# EAGLE design schematic (EAGLE 9.6.2)
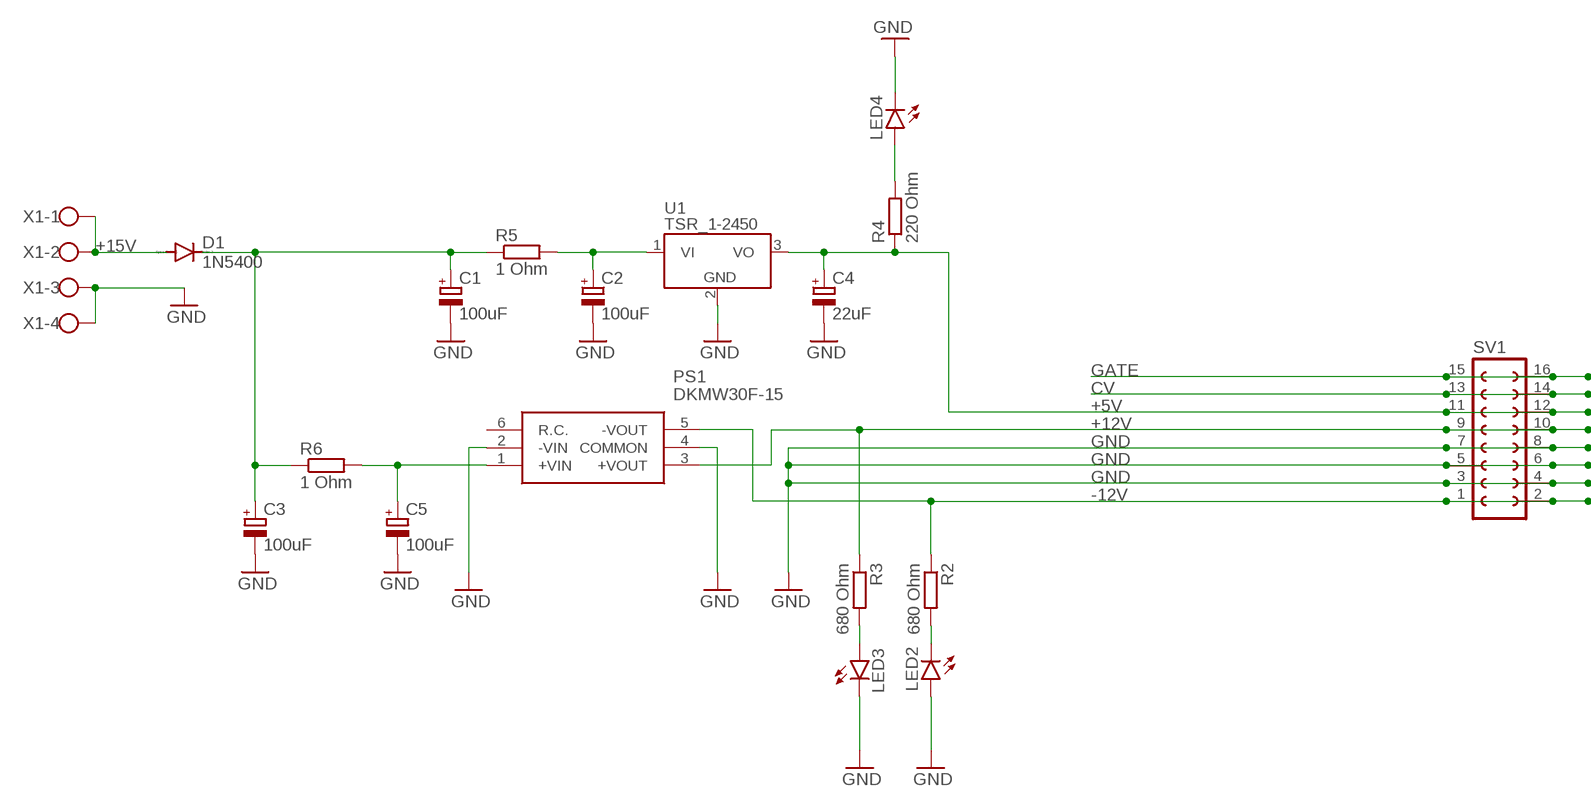
[diagram p0: schematic, sheet 1, part 1 of 2]
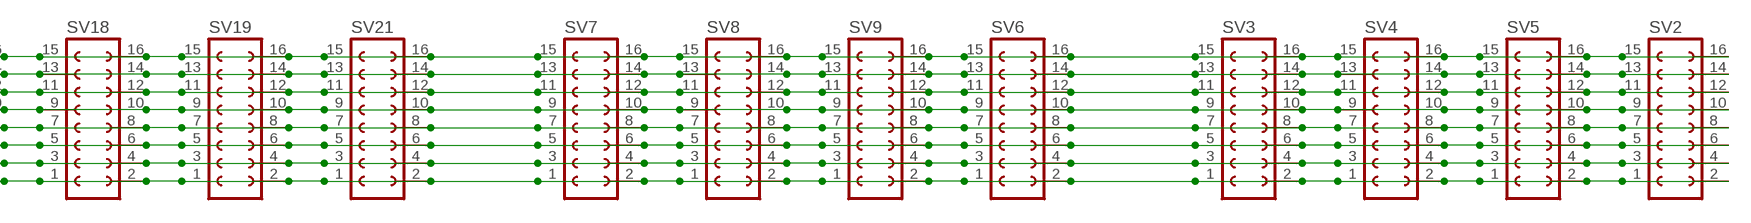
[diagram p1: schematic, sheet 1, part 2 of 2]

## Parts
C1  100uF  CPOL-EUE3.5-8  [E3,5-8]
C2  100uF  CPOL-EUE3.5-8  [E3,5-8]
C3  100uF  CPOL-EUE3.5-8  [E3,5-8]
C4  22uF  CPOL-EUE2.5-5  [E2,5-5]
C5  100uF  CPOL-EUE3.5-8  [E3,5-8]
D1  1N5400  [DO201-15]
LED2  LED3MM  [LED3MM]
LED3  LED3MM  [LED3MM]
LED4  LED3MM  [LED3MM]
PS1  DKMW30F-15  [DKMW30F15]
R2  680 Ohm  R-EU_0207/10  [0207/10]
R3  680 Ohm  R-EU_0207/10  [0207/10]
R4  220 Ohm  R-EU_0207/10  [0207/10]
R5  1 Ohm  R-EU_0207/10  [0207/10]
R6  1 Ohm  R-EU_0207/10  [0207/10]
SV1  FE08-2  [FE08-2]
SV2  FE08-2  [FE08-2]
SV3  FE08-2  [FE08-2]
SV4  FE08-2  [FE08-2]
SV5  FE08-2  [FE08-2]
SV6  FE08-2  [FE08-2]
SV7  FE08-2  [FE08-2]
SV8  FE08-2  [FE08-2]
SV9  FE08-2  [FE08-2]
SV18  FE08-2  [FE08-2]
SV19  FE08-2  [FE08-2]
SV21  FE08-2  [FE08-2]
U1  TSR_1-2450  [TSR-1]
X1  W237-4  [W237-4]

## Nets
+5V: C4.+ R4.1 SV1.11 SV1.12 SV2.11 SV2.12 SV3.11 SV3.12 SV4.11 SV4.12 SV5.11 SV5.12 SV6.11 SV6.12 SV7.11 SV7.12 SV8.11 SV8.12 SV9.11 SV9.12 SV18.11 SV18.12 SV19.11 SV19.12 SV21.11 SV21.12 U1.3(VO)
+12V: PS1.3(+VOUT) R3.1 SV1.9 SV1.10 SV2.9 SV2.10 SV3.9 SV3.10 SV4.9 SV4.10 SV5.9 SV5.10 SV6.9 SV6.10 SV7.9 SV7.10 SV8.9 SV8.10 SV9.9 SV9.10 SV18.9 SV18.10 SV19.9 SV19.10 SV21.9 SV21.10
+15V: D1.A X1.1 X1.2
-12V: PS1.5(-VOUT) R2.1 SV1.1 SV1.2 SV2.1 SV2.2 SV3.1 SV3.2 SV4.1 SV4.2 SV5.1 SV5.2 SV6.1 SV6.2 SV7.1 SV7.2 SV8.1 SV8.2 SV9.1 SV9.2 SV18.1 SV18.2 SV19.1 SV19.2 SV21.1 SV21.2
CV: SV1.13 SV1.14 SV2.13 SV2.14 SV3.13 SV3.14 SV4.13 SV4.14 SV5.13 SV5.14 SV6.13 SV6.14 SV7.13 SV7.14 SV8.13 SV8.14 SV9.13 SV9.14 SV18.13 SV18.14 SV19.13 SV19.14 SV21.13 SV21.14
GATE: SV1.15 SV1.16 SV2.15 SV2.16 SV3.15 SV3.16 SV4.15 SV4.16 SV5.15 SV5.16 SV6.15 SV6.16 SV7.15 SV7.16 SV8.15 SV8.16 SV9.15 SV9.16 SV18.15 SV18.16 SV19.15 SV19.16 SV21.15 SV21.16
GND: C1.- C2.- C3.- C4.- C5.- LED2.A LED3.K(C) LED4.K(C) PS1.2(-VIN) PS1.4(COMMON) SV1.3 SV1.4 SV1.5 SV1.6 SV1.7 SV1.8 SV2.3 SV2.4 SV2.5 SV2.6 SV2.7 SV2.8 SV3.3 SV3.4 SV3.5 SV3.6 SV3.7 SV3.8 SV4.3 SV4.4 SV4.5 SV4.6 SV4.7 SV4.8 SV5.3 SV5.4 SV5.5 SV5.6 SV5.7 SV5.8 SV6.3 SV6.4 SV6.5 SV6.6 SV6.7 SV6.8 SV7.3 SV7.4 SV7.5 SV7.6 SV7.7 SV7.8 SV8.3 SV8.4 SV8.5 SV8.6 SV8.7 SV8.8 SV9.3 SV9.4 SV9.5 SV9.6 SV9.7 SV9.8 SV18.3 SV18.4 SV18.5 SV18.6 SV18.7 SV18.8 SV19.3 SV19.4 SV19.5 SV19.6 SV19.7 SV19.8 SV21.3 SV21.4 SV21.5 SV21.6 SV21.7 SV21.8 U1.2(GND) X1.3 X1.4
N$3: LED2.K(C) R2.2
N$4: LED3.A R3.2
N$5: LED4.A R4.2
N$8: C1.+ C3.+ D1.C R5.1 R6.1
VI: C2.+ R5.2 U1.1(VI)
VI1: C5.+ PS1.1(+VIN) R6.2
Unconnected: PS1.6(R.C.)

## Library data of the parts
C1-C5 = rcl:CPOL-EU: POLARIZED CAPACITOR, European symbol; SPICEPREFIX: C
D1 = diode:1N5400: DIODE standard rectifier, 3 A, 50 V (Motorola)
LED2-LED4 = led:LED: LED OSRAM: - CHIPLED LG R971, LG N971, LY N971, LG Q971, LY Q971, LO R971, LY R971 LH N974, LH R974 LS Q976, LO Q976, LY Q976 LO Q996 - Hyper CHIPLED LW Q18S LB Q993, LB Q99A, LB R99A - SideLED LS A670, LO A670, LY A670, LG A670, LP A670 LB A673, LV A673, LT A673, LW A673 LH A674 LY A675 LS A676, LA A676, LO A676, LY A676, LW A676 LS A679, LY A679, LG A679 - Hyper Micro SIDELED® LS Y876, LA Y876, LO Y876, LY Y876 LT Y87S - SmartLED LW L88C, LW L88S LB L89C, LB L89S, LG L890 LS L89K, LO L89K, LY L89K LS L896, LA L896, LO L896, LY L896 - TOPLED LS T670, LO T670, LY T670, LG T670, LP T670 LSG T670, LSP T670, LSY T670, LOP T670, LYG T670 LG T671, LOG T671, LSG T671 LB T673, LV T673, LT T673, LW T673 LH T674 LS T676, LA T676, LO T676, LY T676, LB T676, LH T676, LSB T676, LW T676 LB T67C, LV T67C, LT T67C, LS T67K, LO T67K, LY T67K, LW E67C LS E67B, LA E67B, LO E67B, LY E67B, LB E67C, LV E67C, LT E67C LW T67C LS T679, LY T679, LG T679 LS T770, LO T770, LY T770, LG T770, LP T770 LB T773, LV T773, LT T773, LW T773 LH T774 LS E675, LA E675, LY E675, LS T675 LS T776, LA T776, LO T776, LY T776, LB T776 LHGB T686 LT T68C, LB T68C - Hyper Mini TOPLED® LB M676 - Mini TOPLED Santana® LG M470 LS M47K, LO M47K, LY M47K Source: http://www.osram.convergy.de LUXEON: - LUMILED® LXK2-PW12-R00, LXK2-PW12-S00, LXK2-PW14-U00, LXK2-PW14-V00 LXK2-PM12-R00, LXK2-PM12-S00, LXK2-PM14-U00 LXK2-PE12-Q00, LXK2-PE12-R00, LXK2-PE12-S00, LXK2-PE14-T00, LXK2-PE14-U00 LXK2-PB12-K00, LXK2-PB12-L00, LXK2-PB12-M00, LXK2-PB14-N00, LXK2-PB14-P00, LXK2-PB14-Q00 LXK2-PR12-L00, LXK2-PR12-M00, LXK2-PR14-Q00, LXK2-PR14-R00 LXK2-PD12-Q00, LXK2-PD12-R00, LXK2-PD12-S00 LXK2-PH12-R00, LXK2-PH12-S00 LXK2-PL12-P00, LXK2-PL12-Q00, LXK2-PL12-R00 Source: www.luxeon.com KINGBRIGHT: KA-3528ASYC Source: www.kingbright.com
PS1 = DKMW30F-15:DKMW30F-15: Isolated DC/DC Converters Source: Datasheet <https://media.digikey.com/pdf/Data Sheets/Mean Well PDF>; ARROW_PART_NUMBER: DKMW30F-15; ARROW_PRICE-STOCK: https://www.arrow.com/en/products/dkmw30f-15/mean-well-enterprises; DESCRIPTION: Isolated DC/DC Converters; HEIGHT: 10.2mm; MANUFACTURER_NAME: Mean Well; MANUFACTURER_PART_NUMBER: DKMW30F-15; MOUSER_PART_NUMBER: 709-DKMW30F-15; MOUSER_PRICE-STOCK: https://www.mouser.co.uk/ProductDetail/MEAN-WELL/DKMW30F-15?qs=5aG0NVq1C4yNc3LnGPT%252BeA%3D%3D
R2-R6 = rcl:R-EU_: RESISTOR, European symbol; SPICEPREFIX: R
SV1-SV9 SV18 SV19 SV21 = con-lsta:FE08-2: FEMALE HEADER; OC_FARNELL: unknown; OC_NEWARK: unknown
U1 = _traco_tsr-1:TSR_1-*: TRACO TSR-1 Series Point-of-Load DC/DC-Converters Vi max. 36 V; Vo = (1.2 .. 15)V ±2%; Io = 0 .. 1 A SIP-Package (drop-in replacement for 78xx linear voltage regulators in TO220-package, vertically assembled) Source: www.tracopower.com Technologies: TSR 1- Vi (V) Vo (V) ±2% Io = 0 .. 1 A 24_ ( generic ) 2412 4.6 .. 36 1.2 2415 4.6 .. 36 1.5 2418 4.6 .. 36 1.8 2425 4.6 .. 36 2.5 2433 4.75.. 36 3.3 2450 6.5 .. 36 5.0 2465 9.0 .. 36 6.5 2490 12 .. 36 9.0 24120 15 .. 36 12 24150 18 .. 36 15 Author: Dipl.-Ing. FH Rainer Bayer HHN Hochschule Heilbronn, rainer.bayer@hs-heilbronn.de Ingenieurbüro ing-rb, mail@ing-rb.de
X1 = con-wago-500:W237-4: WAGO SCREW CLAMP; OC_FARNELL: unknown; OC_NEWARK: unknown

## Board
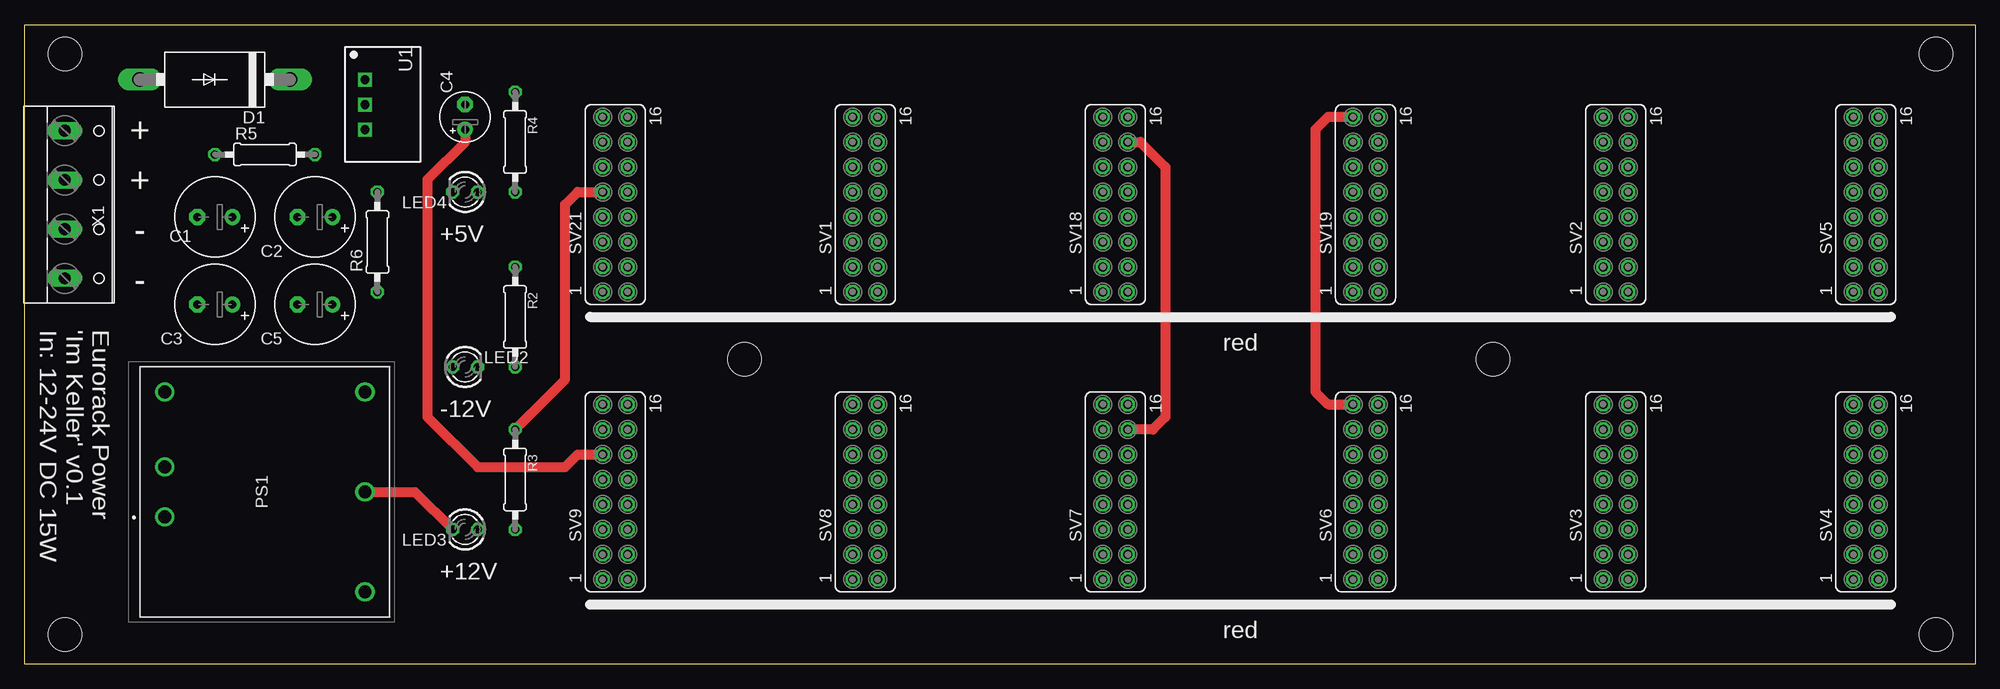
[diagram p2: board, top side]
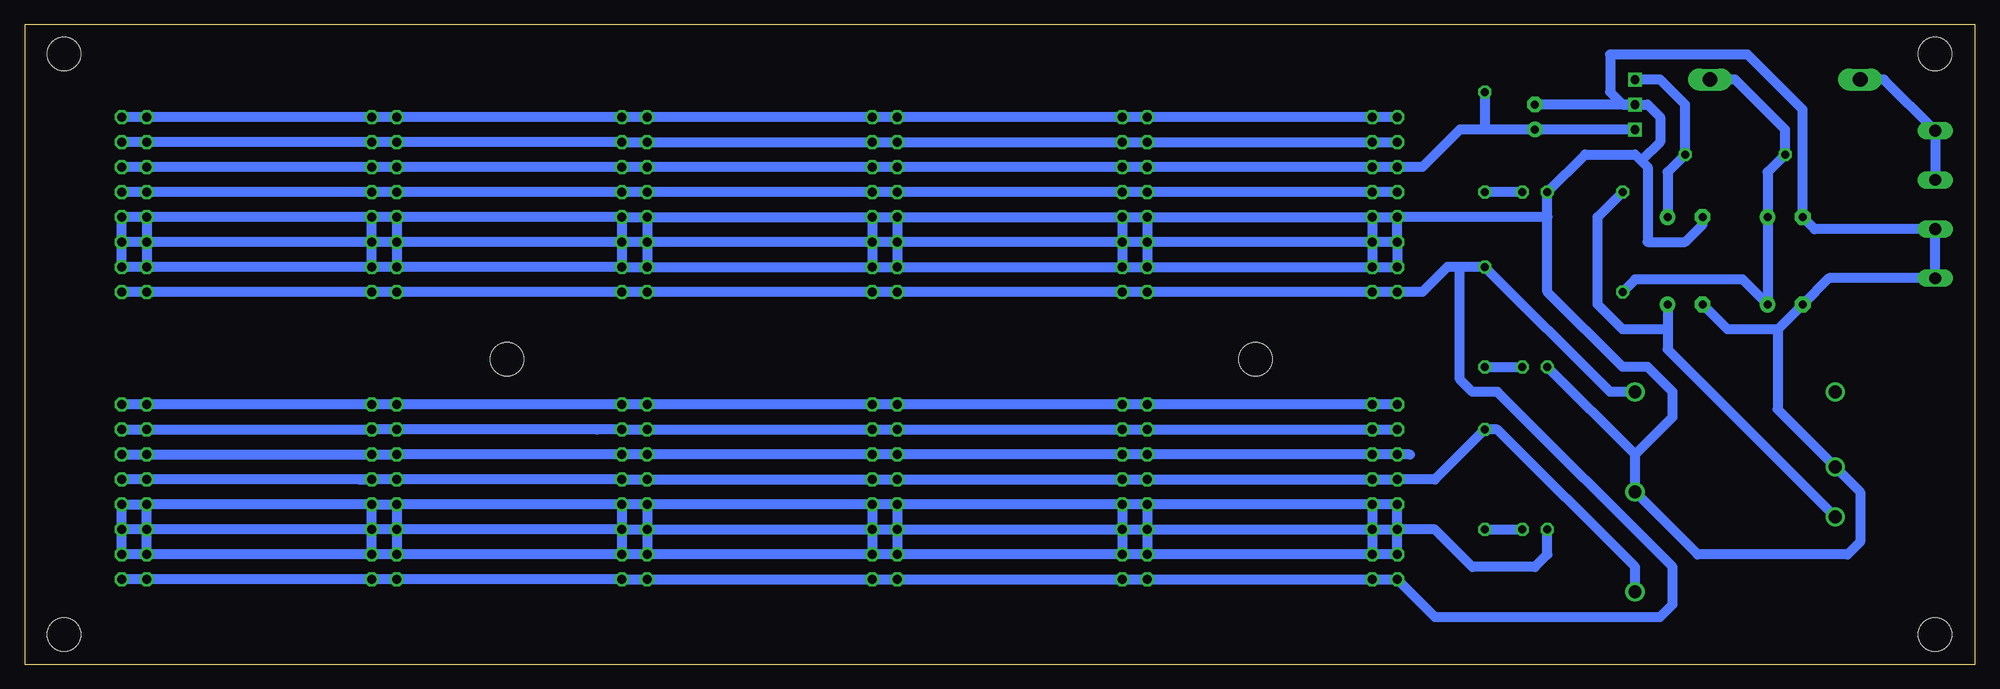
[diagram p3: board, bottom side, seen from below]

Size 198.09 x 65 mm. Coordinates in mm from the lower left corner, seen from the top.
Outline: 0,65 198.09,65 198.09,0 0,0 0,65
Copper layers (1*16): Top 0.035mm / dielectric 1.5mm / Bottom 0.035mm
Design rules "default *": minimum track width 0.8mm, minimum drill 0.35mm, track to track 0.5mm, track to pad 0.5mm, pad to pad 6mil, via to via 6mil, smd to smd 6mil, copper to edge 40mil, drill to drill 6mil, minimum pad ring 10mil, minimum via ring 8mil, stop-mask expansion 4mil, vias tented up to drill 0mil, thermal gap 10mil
Holes 3.4 mm at 4.09,62 4.09,3 194.09,3 194.09,62 73.09,31 149.09,31

### Footprints (pad centres in the part's own frame; a part is rotated, then mirrored left to right if it is on the bottom)
E3,5-8 = drill 0.813 pad 1.6: + -1.778,0 | drill 0.813 pad 1.6 octagon: - 1.778,0
E2,5-5 = drill 0.813 pad 1.6: + -1.27,0 | drill 0.813 pad 1.6 octagon: - 1.27,0
DO201-15 = drill 1.499 long: A 7.62,0; C -7.62,0
LED3MM = drill 0.813 octagon: A -1.27,0; K 1.27,0
DKMW30F15 = drill 1.3 pad 1.95: 1 0,0; 2 -5.08,0; 3 7.62,20.32; 4 -2.54,20.32; 5 -12.7,20.32; 6 -12.7,0
0207/10 = drill 0.813 octagon: 1 -5.08,0; 2 5.08,0
FE08-2 = drill 0.914 octagon: 1 -8.89,1.27; 2 -8.89,-1.27; 3 -6.35,1.27; 4 -6.35,-1.27; 5 -3.81,1.27; 6 -3.81,-1.27; 7 -1.27,1.27; 8 -1.27,-1.27; 9 1.27,1.27; 10 1.27,-1.27; 11 3.81,1.27; 12 3.81,-1.27; 13 6.35,1.27; 14 6.35,-1.27; 15 8.89,1.27; 16 8.89,-1.27
TSR-1 = drill 0.9 square: 1 -2.54,0; 2 0,0; 3 2.54,0
W237-4 = drill 1.194 long: 1 -7.5,-1.27; 2 -2.5,-1.27; 3 2.5,-1.27; 4 7.5,-1.27

### Placement (x,y rotation side)
C1  19.32,45.45 180 top
C2  29.48,45.45 180 top
C3  19.32,36.56 180 top
C4  44.72,55.61 90 top
C5  29.48,36.56 180 top
D1  19.32,59.42 180 top
LED2  44.72,30.21 0 top
LED3  44.72,13.7 180 top
LED4  44.72,47.99 180 top
PS1  14.24,14.97 270 top
R2  49.8,35.29 270 top
R3  49.8,18.78 270 top
R4  49.8,53.07 270 top
R5  24.4,51.8 0 top
R6  35.83,42.91 90 top
SV1  85.36,46.72 90 top
SV2  161.56,46.72 90 top
SV3  161.56,17.51 90 top
SV4  186.96,17.51 90 top
SV5  186.96,46.72 90 top
SV6  136.16,17.51 90 top
SV7  110.76,17.51 90 top
SV8  85.36,17.51 90 top
SV9  59.96,17.51 90 top
SV18  110.76,46.72 90 top
SV19  136.16,46.72 90 top
SV21  59.96,46.72 90 top
U1  34.56,56.88 270 top
X1  5.35,46.72 270 top

### Tracks (layer width: path | path; a pad name or v marks a point on that pad's centre or on a via)
+5V
  Top 1: C4.+ 44.72,53.07 40.91,49.26 40.91,25.13 45.99,20.05 54.88,20.05 56.15,21.32 SV9.11
  Bottom 1: U1.3 C4.+ 49.8,54.34 | 49.8,54.34 52.34,54.34 56.15,50.53 SV21.11 SV21.12 SV1.11 SV1.12 SV18.11 SV18.12 SV19.11 SV19.12 SV2.11 SV2.12 SV5.11 SV5.12 | R4.1 49.8,54.34 | 57.42,21.32 SV9.11 SV9.12 SV8.11 SV8.12 SV7.11 SV7.12 SV6.11 SV6.12 SV3.11 SV3.12 SV4.11 SV4.12
+12V
  Top 1: R3.1 54.88,28.94 54.88,46.72 56.15,47.99 SV21.9
  Bottom 1: SV21.9 SV21.10 SV1.9 SV1.10 SV18.9 SV18.10 SV19.9 SV19.10 SV2.9 SV2.10 SV5.9 SV5.10 | PS1.3 34.56,9.89 48.53,23.86 R3.1 54.88,18.78 SV9.9 SV9.10 SV8.9 SV8.10 SV7.9 SV7.10 SV6.9 SV6.10 SV3.9 SV3.10 | 164.1,18.78 SV3.10 | SV3.10 SV4.9 SV4.10
+15V
  Bottom 1: 11.66,59.38 D1.A 9.28,59.42 X1.1 X1.2
-12V
  Bottom 1: PS1.5 37.1,27.67 R2.1 52.34,40.37 | 52.34,40.37 52.34,28.94 51.07,27.67 48.53,27.67 30.75,9.89 30.75,6.08 32.02,4.81 54.88,4.81 SV9.1 SV9.2 SV8.1 SV8.2 SV7.1 SV7.2 SV6.1 SV6.2 SV3.1 SV3.2 SV4.1 SV4.2 | 52.34,40.37 53.61,40.37 56.15,37.83 SV21.1 SV21.2 SV1.1 SV1.2 SV18.1 SV18.2 SV19.1 SV19.2 SV2.1 SV2.2 SV5.1 SV5.2
CV
  Top 1: SV18.14 113.3,53.07 115.84,50.53 115.84,25.13 114.57,23.86 SV7.14
  Bottom 1: SV21.13 SV21.14 SV1.13 SV1.14 SV18.13 SV18.14 SV19.13 SV19.14 SV2.13 SV2.14 SV5.13 SV5.14 | SV6.14 SV6.13 SV7.14 SV7.13 SV8.14 SV8.13 SV9.14 SV9.13 | SV6.14 139.97,23.86 | SV6.14 SV3.13 SV3.14 SV4.13 SV4.14
GATE
  Top 1: SV6.15 132.35,26.4 131.08,27.67 131.08,54.34 132.35,55.61 SV19.15
  Bottom 1: SV21.15 SV21.16 SV1.15 SV1.16 SV18.15 SV18.16 SV19.15 SV19.16 SV2.15 SV2.16 SV5.15 SV5.16 | SV9.15 SV9.16 SV8.15 SV8.16 SV7.15 SV7.16 SV6.15 SV6.16 SV3.15 SV3.16 SV4.15 SV4.16
GND
  Top 1: PS1.4 39.64,17.51 LED3.K
  Bottom 1: SV9.5 SV9.3 SV9.4 | SV9.5 SV9.7 SV9.8 | SV21.5 SV21.7 | SV21.5 SV21.3 SV21.4 | SV19.8 SV19.6 | SV19.6 SV19.4 | SV19.8 SV19.7 | SV19.7 SV18.8 | SV18.8 SV18.7 | SV18.7 SV1.8 | SV1.8 SV1.7 | SV1.7 SV21.8 | SV21.8 SV21.7 | SV21.5 SV21.6 SV1.5 SV1.6 SV18.5 SV18.6 SV19.5 SV19.6 | SV19.4 SV19.3 | SV19.3 SV18.4 | SV18.4 SV18.3 | SV18.3 SV1.4 | SV1.4 SV1.3 | SV1.3 SV21.4 | SV8.7 SV8.8 | SV8.8 SV7.7 | SV7.7 SV7.8 | SV7.8 SV6.7 | SV6.7 SV6.8 | SV9.5 SV9.6 SV8.5 SV8.6 SV7.5 SV7.6 SV6.5 SV6.6 SV3.5 SV3.6 | SV9.4 SV8.3 | SV8.3 SV8.4 | SV8.4 SV7.3 | SV7.3 SV7.4 | SV7.4 SV6.3 | SV6.3 SV6.4 | SV1.7 SV1.3 | SV18.7 SV18.3 | SV7.7 SV7.3 | SV8.7 SV8.3 | SV9.8 SV9.4 | SV6.7 SV6.3 | SV19.7 SV19.3 | SV1.8 SV1.4 | SV21.8 SV21.4 | 20.08,34.02 C3.- 14.88,39.22 X1.4 X1.3 16.31,44.22 C1.- 17.54,56.37 23.13,61.96 37.1,61.96 37.1,58.15 35.83,56.88 U1.2 | C5.- 25.16,34.02 20.08,34.02 | 20.08,34.02 20.08,25.89 PS1.2 11.7,17.51 11.7,12.43 12.97,11.16 28.21,11.16 PS1.4 34.56,21.32 | U1.2 C4.- | U1.2 33.29,56.88 32.02,55.61 32.02,53.07 33.93,51.16 | C2.- 27.7,44.69 29.48,42.91 33.29,42.91 33.29,50.53 33.93,51.16 | 34.56,21.32 30.75,25.13 30.75,27.67 33.29,30.21 35.83,30.21 43.45,37.83 43.45,45.45 | 43.45,45.45 LED4.K 39.64,51.8 34.56,51.8 33.93,51.16 | 43.45,45.45 SV21.7 | 34.56,21.32 LED2.A | LED3.K 43.45,11.16 44.72,9.89 51.07,9.89 54.88,13.7 SV9.5 | SV8.8 SV8.4 | SV7.8 SV7.4 | SV6.8 SV6.4 | SV9.8 SV8.7 | SV19.8 SV2.7 | SV2.7 SV2.5 | SV2.5 SV2.3 | SV2.3 SV2.4 | SV2.4 SV2.6 | SV2.6 SV2.8 | SV2.8 SV5.7 | SV2.7 SV2.8 | SV2.5 SV2.6 | SV5.7 SV5.3 | SV5.6 SV5.4 SV5.3 | SV5.6 SV5.8 SV5.7 | SV5.6 SV5.5 SV2.6 | SV19.4 SV2.3 | SV19.6 SV2.5 | SV2.4 SV5.3 | SV6.4 SV3.3 | SV6.8 SV3.7 | SV3.7 SV3.3 | SV3.3 SV3.4 | SV3.4 SV3.6 | SV3.6 SV3.8 | SV3.8 SV3.7
  Bottom 1: SV3.8 SV4.7 | SV3.6 SV4.5 SV4.6 | SV3.4 SV4.3 | SV4.3 SV4.4 SV4.6 | SV4.6 SV4.8 SV4.7 | SV4.3 SV4.7 | SV18.8 SV18.4
N$3
  Bottom 1: R2.2 LED2.K
N$4
  Bottom 1: R3.2 LED3.A
N$5
  Bottom 1: LED4.A R4.2
N$8
  Bottom 1: D1.C 24.4,59.42 19.32,54.34 R5.1 21.1,50.02 C1.+ C3.+ 23.64,39.1 34.56,39.1 R6.1
VI
  Bottom 1: U1.1 32.02,59.42 29.48,56.88 R5.2 31.26,50.02 C2.+
VI1
  Bottom 1: C5.+ 31.26,34.02 | 31.26,34.02 31.26,31.99 PS1.1 | 31.26,34.02 35.83,34.02 38.37,36.56 38.37,45.45 R6.2

### Text on the board
tPlace: + | + | - | +5V | - | Eurorack Power / 'Im Keller' v0.1 / In: 12-24V DC 15W | red | -12V | +12V | red